# Altium schematic sheet ControlVCCLS.SchDoc
size A
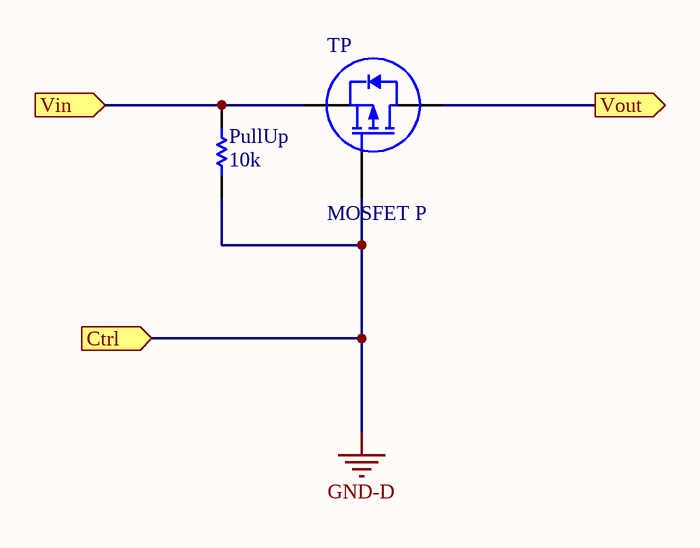
[diagram p0: ControlVCCLS.SchDoc]

## Parts
PullUp  10k  [0805]
TP  MOSFET P  [SOT23]

## Ports
Ctrl (in), Vin (in), Vout (out)

## Nets
GND-D: PullUp.1 TP.1(G) ; port Ctrl
Vin: PullUp.2 TP.3(S) ; port Vin
Vout: TP.2(D) ; port Vout

## Library data of the parts
PullUp = RES